# EAGLE design UserInterface_RevC (EAGLE 7.6.0)

## Sheet 1 of 2
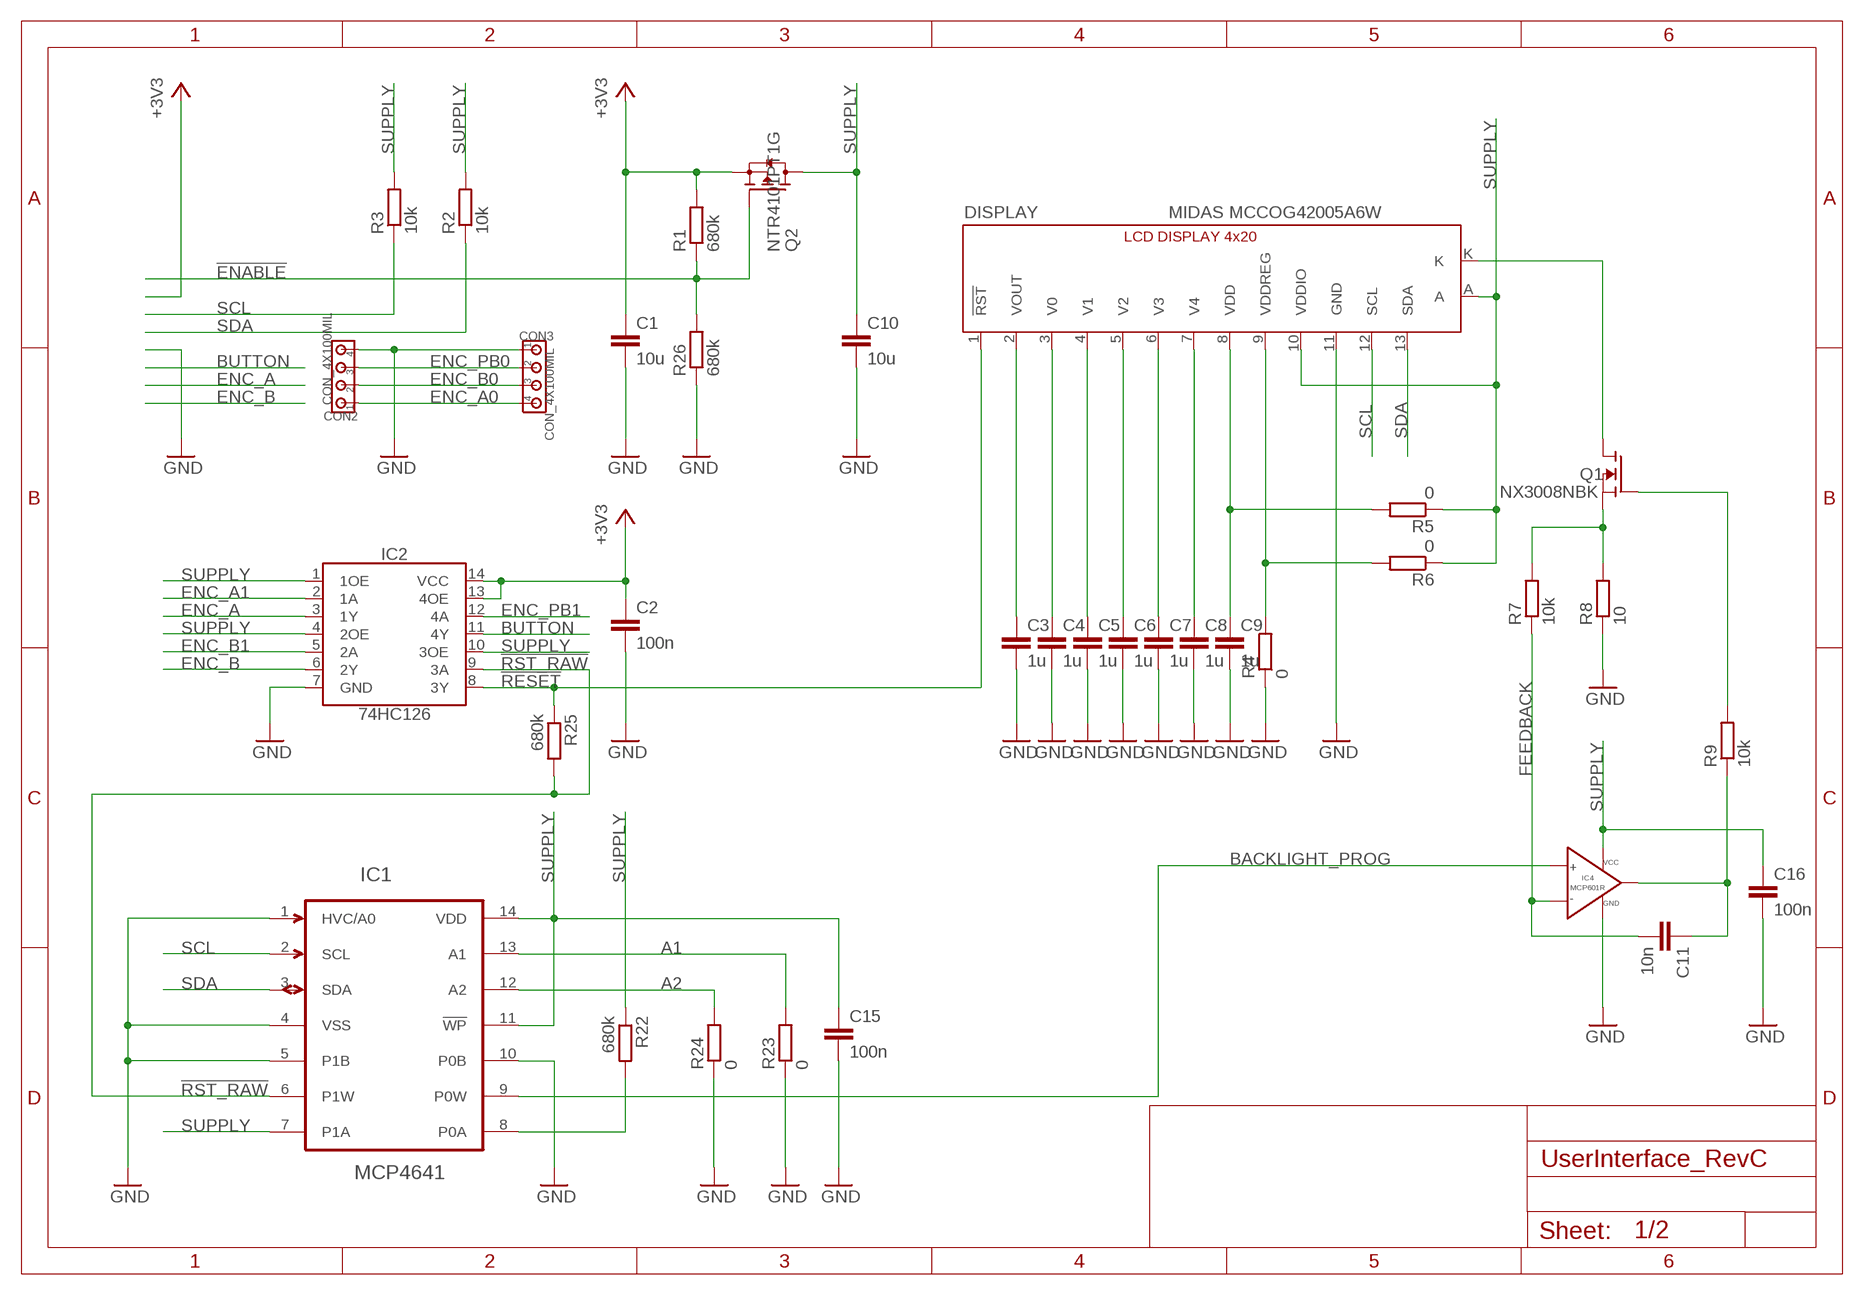
[diagram p0: schematic, sheet 1]

### Parts
C1  10u  CC0805  [C0805]
C2  100n  CC0805  [C0805]
C3  1u  CC0805  [C0805]
C4  1u  CC0805  [C0805]
C5  1u  CC0805  [C0805]
C6  1u  CC0805  [C0805]
C7  1u  CC0805  [C0805]
C8  1u  CC0805  [C0805]
C9  1u  CC0805  [C0805]
C10  10u  CC0805  [C0805]
C11  10n  CC0805  [C0805]
C15  100n  CC0805  [C0805]
C16  100n  CC0805  [C0805]
CON2  CON_4X100MIL  [100MIL_4X]
CON3  CON_4X100MIL  [100MIL_4X]
DISPLAY  MIDAS MCCOG42005A6W  LCD4X20_I2C  [LCD_4X20_I2C]
IC1  MCP4641  [TSSOP14]
IC2  74HC126  [SO14]
IC4  MCP601R  [SOT-23-5]
Q1  NX3008NBK  N-FETSOT23  [SOT23]
Q2  NTR4101PT1G  P-FETSOT23  [SOT23]
R1  680k  RESISTORR0805  [R0805]
R2  10k  RESISTORR0805  [R0805]
R3  10k  RESISTORR0805  [R0805]
R4  0  RESISTORR0805  [R0805]
R5  0  RESISTORR0805  [R0805]
R6  0  RESISTORR0805  [R0805]
R7  10k  RESISTORR0805  [R0805]
R8  10  RESISTORR0805  [R0805]
R9  10k  RESISTORR0805  [R0805]
R22  680k  RESISTORR0805  [R0805]
R23  0  RESISTORR0805  [R0805]
R24  0  RESISTORR0805  [R0805]
R25  680k  RESISTORR0805  [R0805]
R26  680k  RESISTORR0805  [R0805]

### Nets
!ENABLE!: Q2.1(G) R1.1 R26.2 ; also sheet 2
!RESET!: DISPLAY.1(!RST!) IC2.8(3Y) R25.1
!RST_RAW!: IC1.6(P1W) IC2.9(3A) R25.2
+3V3: C1.1 C2.1 IC2.13(4OE) IC2.14(VCC) Q2.2(S) R1.2 ; also sheet 2
A1: IC1.13(A1) R23.2
A2: IC1.12(A2) R24.2
BACKLIGHT_PROG: IC1.9(P0W) IC4.3(VIN+)
BUTTON: IC2.11(4Y) ; also sheet 2
ENC_A: IC2.3(1Y) ; also sheet 2
ENC_A0: CON2.1 CON3.4 ; also sheet 2
ENC_A1: IC2.2(1A) ; also sheet 2
ENC_B: IC2.6(2Y) ; also sheet 2
ENC_B0: CON2.2 CON3.3 ; also sheet 2
ENC_B1: IC2.5(2A) ; also sheet 2
ENC_PB0: CON2.3 CON3.2 ; also sheet 2
ENC_PB1: IC2.12(4A) ; also sheet 2
FEEDBACK: C11.2 IC4.4(VIN-) R7.1
GND: C1.2 C2.2 C3.2 C4.2 C5.2 C6.2 C7.2 C8.2 C9.2 C10.2 C15.2 C16.2 CON2.4 CON3.1 DISPLAY.11(GND) IC1.1(HVC/A0) IC1.4(VSS) IC1.5(P1B) IC1.10(P0B) IC2.7(GND) IC4.5(GND) R4.1 R8.1 R23.1 R24.1 R26.1 ; also sheet 2
LED_K: DISPLAY.K Q1.3(D)
N$3: C3.1 DISPLAY.2(VOUT)
N$4: C4.1 DISPLAY.3(V0)
N$5: C8.1 DISPLAY.7(V4)
N$6: C7.1 DISPLAY.6(V3)
N$7: C6.1 DISPLAY.5(V2)
N$8: C5.1 DISPLAY.4(V1)
N$14: C11.1 IC4.1(VOUT) R9.1
N$15: Q1.1(G) R9.2
N$17: Q1.2(S) R7.2 R8.2
N$19: IC1.8(P0A) R22.2
SCL: DISPLAY.12(SCL) IC1.2(SCL) R3.1 ; also sheet 2
SDA: DISPLAY.13(SDA) IC1.3(SDA) R2.1 ; also sheet 2
SUPPLY: C10.1 C15.1 C16.1 DISPLAY.10(VDDIO) DISPLAY.A IC1.7(P1A) IC1.11(!WP!) IC1.14(VDD) IC2.1(1OE) IC2.4(2OE) IC2.10(3OE) IC4.2(VCC) Q2.3(D) R2.2 R3.2 R5.1 R6.1 R22.1 ; also sheet 2
VDD: C9.1 DISPLAY.8(VDD) R5.2
VDREG: DISPLAY.9(VDDREG) R4.2 R6.2

## Sheet 2 of 2
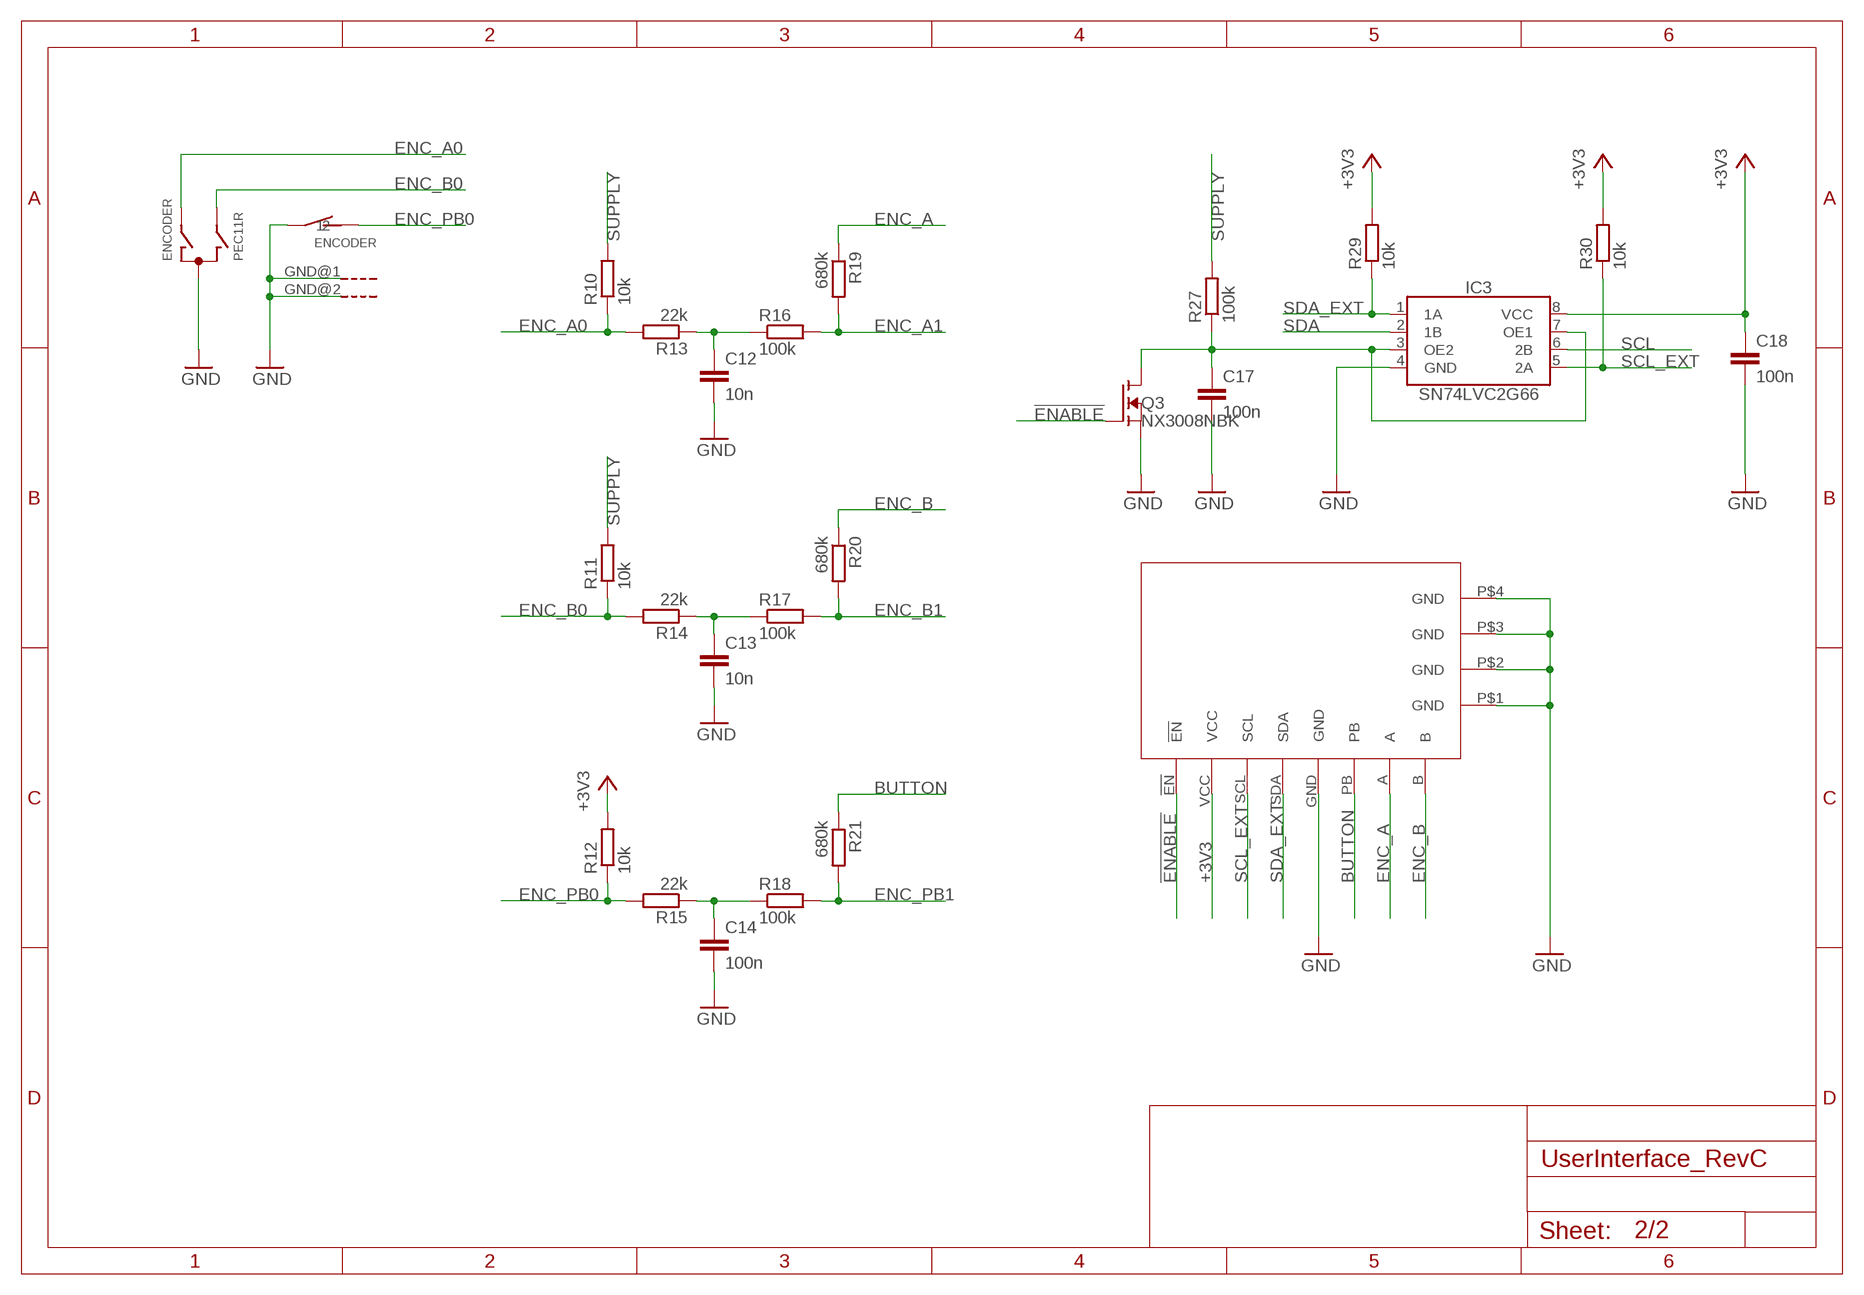
[diagram p1: schematic, sheet 2]

### Parts
C12  10n  CC0805  [C0805]
C13  10n  CC0805  [C0805]
C14  100n  CC0805  [C0805]
C17  100n  CC0805  [C0805]
C18  100n  CC0805  [C0805]
ENCODER  PEC11R  ENCODER_BOURNS  [ENCODER_BOURNS]
IC3  SN74LVC2G66  [SSOP8]
Q3  NX3008NBK  N-FETSOT23  [SOT23]
R10  10k  RESISTORR0805  [R0805]
R11  10k  RESISTORR0805  [R0805]
R12  10k  RESISTORR0805  [R0805]
R13  22k  RESISTORR0805  [R0805]
R14  22k  RESISTORR0805  [R0805]
R15  22k  RESISTORR0805  [R0805]
R16  100k  RESISTORR0805  [R0805]
R17  100k  RESISTORR0805  [R0805]
R18  100k  RESISTORR0805  [R0805]
R19  680k  RESISTORR0805  [R0805]
R20  680k  RESISTORR0805  [R0805]
R21  680k  RESISTORR0805  [R0805]
R27  100k  RESISTORR0805  [R0805]
R29  10k  RESISTORR0805  [R0805]
R30  10k  RESISTORR0805  [R0805]
U$1  DISPLAY_UNIT  [DISPLAY_UNIT]

### Nets
!ENABLE!: Q3.1(G) U$1.!EN! ; also sheet 1
+3V3: C18.1 IC3.8(VCC) R12.2 R29.2 R30.2 U$1.VCC ; also sheet 1
BUTTON: R21.1 U$1.PB ; also sheet 1
ENC_A: R19.1 U$1.A ; also sheet 1
ENC_A0: ENCODER.A R10.1 R13.2 ; also sheet 1
ENC_A1: R16.2 R19.2 ; also sheet 1
ENC_B: R20.1 U$1.B ; also sheet 1
ENC_B0: ENCODER.B R11.1 R14.2 ; also sheet 1
ENC_B1: R17.2 R20.2 ; also sheet 1
ENC_PB0: ENCODER.1 R12.1 R15.2 ; also sheet 1
ENC_PB1: R18.2 R21.2 ; also sheet 1
GND: C12.2 C13.2 C14.2 C17.2 C18.2 ENCODER.2 ENCODER.C ENCODER.GND@1(G) ENCODER.GND@2(G) IC3.4(GND) Q3.2(S) U$1.GND U$1.P$1(GND) U$1.P$2(GND) U$1.P$3(GND) U$1.P$4(GND) ; also sheet 1
N$1: C17.1 IC3.3(OE2) IC3.7(OE1) Q3.3(D) R27.1
N$9: C13.1 R14.1 R17.1
N$12: C12.1 R13.1 R16.1
N$13: C14.1 R15.1 R18.1
SCL: IC3.6(2B) ; also sheet 1
SCL_EXT: IC3.5(2A) R30.1 U$1.SCL
SDA: IC3.2(1B) ; also sheet 1
SDA_EXT: IC3.1(1A) R29.1 U$1.SDA
SUPPLY: R10.2 R11.2 R27.2 ; also sheet 1

## Library data of the parts
C1-C18 = 00Capacitor:C: Capacitor
CON2 CON3 = 00Connector:CON_4X: 4-pin header
DISPLAY = 00Display:LCD4X20_I2C: 4x20 character LCD display with I2C interface
ENCODER = 00Switch:ENCODER_BOURNS: Bourns Rotary Encoder with Switch PEC11-4xxxF-Sxxxx
IC1 = 00DigiPot:MCP4641: Dual DigiPot with 128 steps and non-volatile memory
IC2 = 00Logic:74HC126: Quad buffer/line driver; 3-state
IC3 = 00Logic:SN74LVC2G66: Dual Bilateral Analog Switch
IC4 = 00OpAmp:MCP601R
Q1 Q3 = 00Mosfet:N-FET: N-Channel MOSFET
Q2 = 00Mosfet:P-FET
R1-R27 R29 R30 = 00Resistor:RESISTOR: RESISTOR, European symbol
U$1 = 00Drill:DISPLAY_UNIT: Display Unit

## Board
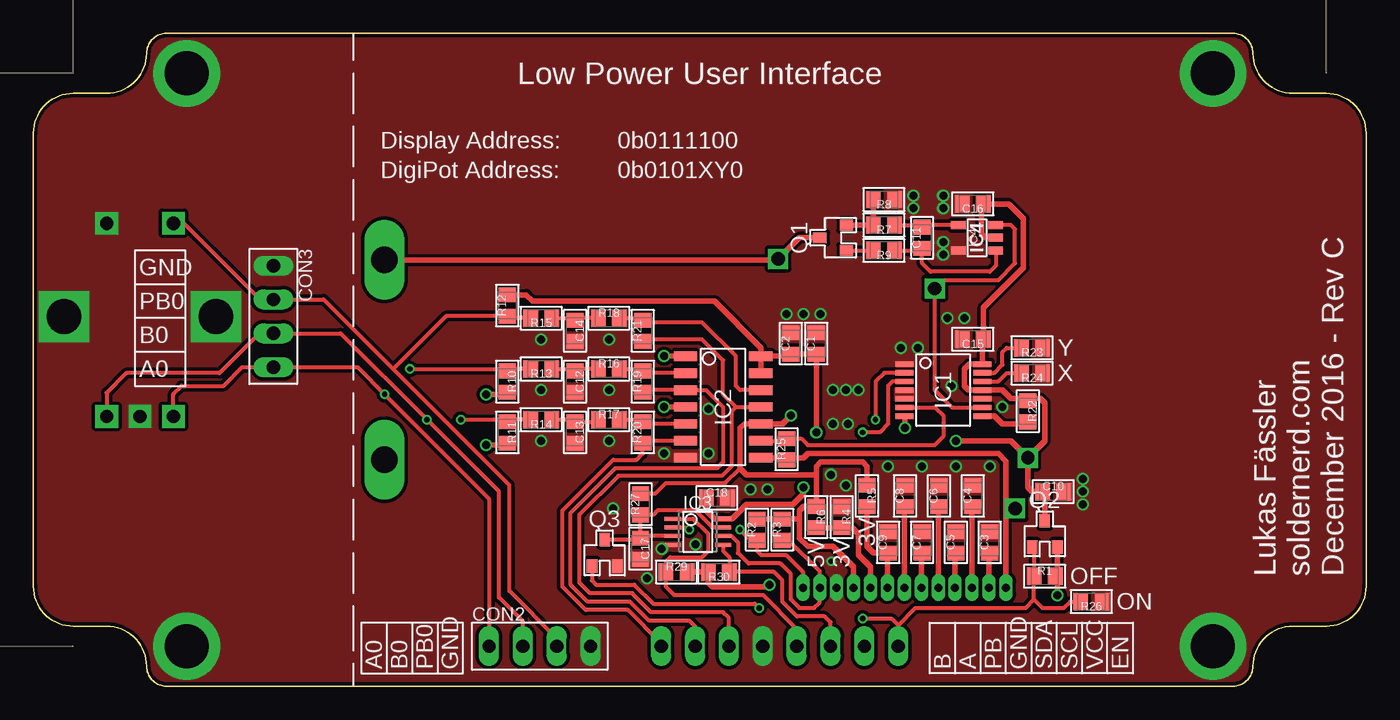
[diagram p2: board, top side]
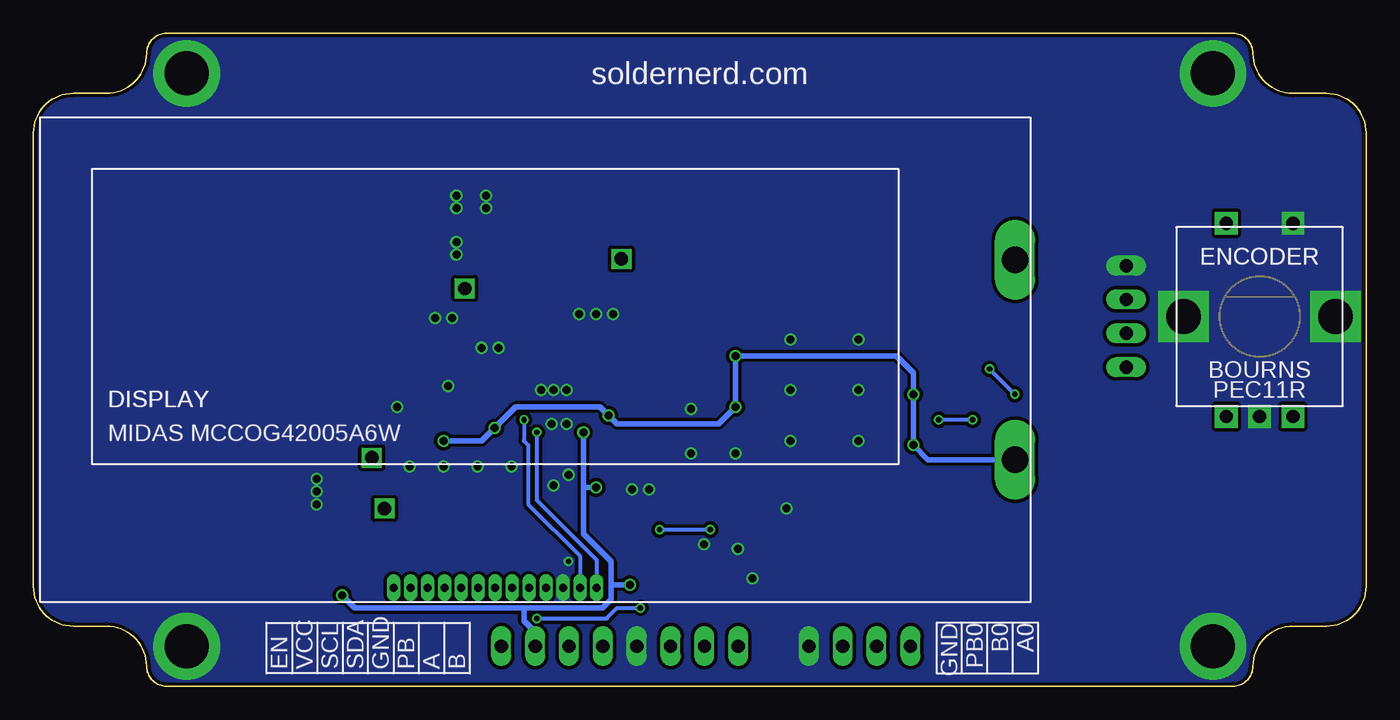
[diagram p3: board, bottom side, seen from below]

Size 100 x 49 mm. Coordinates in mm from the lower left corner, seen from the top.
Outline: 0,41.5 arc-90 3,44.5 5.5,44.5 arc90 8.5,47.5 arc-90 10,49 90,49 arc-90 91.5,47.5 arc90 94.5,44.5 97,44.5 arc-90 100,41.5 100,7.5 arc-90 97,4.5 94.5,4.5 arc90 91.5,1.5 arc-90 90,0 10,0 arc-90 8.5,1.5 arc90 5.5,4.5 3,4.5 arc-90 0,7.5 0,41.5
Copper layers (1*16): Top 0.035mm / dielectric 1.5mm / Bottom 0.035mm
Design rules "dirt_cheap_dirty_boards.8mil": minimum track width 5mil, minimum drill 12mil, track to track 8mil, track to pad 8mil, pad to pad 8mil, via to via 8mil, smd to smd 0mil, copper to edge 10mil, drill to drill 10mil, minimum pad ring 8mil, minimum via ring 6mil, stop-mask expansion 2mil, vias tented up to drill 25mil, thermal gap 10mil

### Footprints (pad centres in the part's own frame; a part is rotated, then mirrored left to right if it is on the bottom)
C0805 = smd 1.1 x 1.3: 1 -0.8,0; 2 0.8,0
100MIL_4X = drill 1 long: 1 -3.81,0; 2 -1.27,0; 3 1.27,0; 4 3.81,0
LCD_4X20_I2C = drill 0.6 pad 0.9 long: 1 26.53,1.1; 2 27.8,1.1; 3 29.07,1.1; 4 30.34,1.1; 5 31.61,1.1; 6 32.88,1.1; 7 34.15,1.1; 8 35.42,1.1; 9 36.69,1.1; 10 37.96,1.1; 11 39.23,1.1; 12 40.5,1.1; 13 41.77,1.1 | drill 2 long: A 73.15,10.7; K 73.15,25.7
ENCODER_BOURNS = drill 1 pad 1.7 square: 1 -2.5,7; 2 2.5,7; A -2.5,-7.5; B 2.5,-7.5; C 0,-7.5 | drill 2.6 pad 3.8 square: GND@1 -5.7,0; GND@2 5.7,0
TSSOP14 = smd 0.4 x 1.35: 1 -1.95,-2.925; 2 -1.3,-2.925; 3 -0.65,-2.925; 4 0,-2.925; 5 0.65,-2.925; 6 1.3,-2.925; 7 1.95,-2.925; 8 1.95,2.925; 9 1.3,2.925; 10 0.65,2.925; 11 0,2.925; 12 -0.65,2.925; 13 -1.3,2.925; 14 -1.95,2.925
SO14 = smd 0.7 x 1.75: 1 -3.81,-2.825; 2 -2.54,-2.825; 3 -1.27,-2.825; 4 0,-2.825; 5 1.27,-2.825; 6 2.54,-2.825; 7 3.81,-2.825; 8 3.81,2.825; 9 2.54,2.825; 10 1.27,2.825; 11 0,2.825; 12 -1.27,2.825; 13 -2.54,2.825; 14 -3.81,2.825
SSOP8 = smd 1.2 x 0.3: 1 -1.9,0.975; 2 -1.9,0.325; 3 -1.9,-0.325; 4 -1.9,-0.975; 5 1.9,-0.975; 6 1.9,-0.325; 7 1.9,0.325; 8 1.9,0.975
SOT-23-5 = smd 0.6 x 1.1: 1 -0.95,-1.4; 2 0,-1.4; 3 0.95,-1.4; 4 0.95,1.4; 5 -0.95,1.4
SOT23 = smd 0.8 x 1: 1 -0.95,-1; 2 0.95,-1; 3 0,1
R0805 = smd 1.1 x 1.3: 1 -0.8,0; 2 0.8,0
DISPLAY_UNIT = drill 1 long: !EN! 35.11,3; A 50.35,3; B 52.89,3; GND 45.27,3; PB 47.81,3; SCL 40.19,3; SDA 42.73,3; VCC 37.65,3 | drill 3.3 pad 5: P$1 11.5,3; P$2 88.5,3; P$3 11.5,46; P$4 88.5,46

### Placement (x,y rotation side)
C1  58.74,25.72 90 top
C2  56.83,25.72 90 top
C3  71.75,10.79 90 top
C4  70.48,14.29 90 top
C5  69.22,10.79 90 top
C6  67.94,14.29 90 top
C7  66.67,10.79 90 top
C8  65.41,14.29 90 top
C9  64.14,10.79 90 top
C10  76.52,14.61 0 top
C11  66.67,33.66 90 top
C12  40.64,22.86 270 top
C13  40.64,19.05 270 top
C14  40.64,26.67 270 top
C15  70.48,26.04 180 top
C16  70.48,36.2 180 top
C17  45.56,10.32 270 top
C18  51.28,14.13 0 top
CON2  38,3 0 top
CON3  18,27.75 270 top
DISPLAY  99.5,6.3 0 bottom
ENCODER  8,27.75 0 bottom
IC1  68.26,22.23 270 top
IC2  51.75,20.95 270 top
IC3  49.85,11.59 0 top
IC4  70.8,33.66 90 top
Q1  60.01,33.66 90 top
Q2  75.88,11.43 0 top
Q3  42.86,10 0 top
R1  75.88,8.26 0 top
R2  54.29,11.75 90 top
R3  56.2,11.75 90 top
R4  60.64,12.7 270 top
R5  62.55,14.29 270 top
R6  58.74,12.7 270 top
R7  63.82,34.61 180 top
R8  63.82,36.51 180 top
R9  63.82,32.7 180 top
R10  35.56,22.86 270 top
R11  35.56,19.05 270 top
R12  35.56,28.57 90 top
R13  38.1,23.81 180 top
R14  38.1,20 180 top
R15  38.1,27.62 180 top
R16  43.18,23.81 0 top
R17  43.18,20 0 top
R18  43.18,27.62 0 top
R19  45.72,22.86 90 top
R20  45.72,19.05 90 top
R21  45.72,26.67 90 top
R22  74.61,20.64 270 top
R23  74.93,25.4 180 top
R24  74.93,23.5 180 top
R25  56.52,17.78 90 top
R26  79.38,6.35 180 top
R27  45.56,13.65 90 top
R29  48.26,8.57 0 top
R30  51.44,8.57 180 top
U$1  100,0 0 bottom

### Tracks (layer width: path | path; a pad name or v marks a point on that pad's centre or on a via)
!ENABLE!  (via drill 0.4)
  Top 0.305: 64.89,4.57 66.2,5.87 74.45,5.87 75.08,6.5 | 75.08,6.5 R1.1 75.08,10.28 | 75.08,6.5 75.71,5.87 77.31,5.87 77.79,6.35 R26.2 | 64.89,4.57 U$1.!EN! | Q3.1 41.91,7.93 42.23,7.62 45.09,7.62 46.51,6.19 54.13,6.19 v54.45,5.87 | v62.23,5.08 64.38,5.08 64.89,4.57
  Top 0.406: Q2.1 75.08,10.28
  Bottom 0.305: v62.23,5.08 56.99,5.08 56.2,5.87 v54.45,5.87
!RESET!  (via drill 1)
  Top 0.406: DISPLAY.1 72.97,13.34 | 72.97,13.34 72.97,16.88 72.39,17.46 58.1,17.46 57.78,17.14 56.52,17.14 R25.1 56.35,17.14 IC2.8 | v73.66,13.34 72.97,13.34
!RST_RAW!
  Top 0.305: IC2.9 56.35,18.41 | R25.2 57.62,18.58 58.1,18.1 67.63,18.1 68.26,18.73 68.26,20.32 67.66,20.93 IC1.6
  Top 0.406: 56.35,18.41 R25.2
+3V3  (via drill 0.6)
  Top 0.305: R30.2 50.63,7.94
  Top 0.406: v58.74,19.05 C1.1 C2.1 56.83,24.8 54.61,24.8 | R12.2 36.98,29.38 37.47,28.89 51.12,28.89 54.61,25.4 54.61,24.8 | IC2.13 IC2.14 54.61,24.8 | Q2.2 76.83,8.4 | v76.83,6.83 76.83,8.1 | R29.2 R30.2 50.63,7.79 50.96,7.46 55.09,7.46 v55.24,7.62 | C18.1 50.48,13.18 51.09,12.56 IC3.8 52.41,12.56 53.5,13.65 56.99,13.65 57.78,14.45 v57.78,14.92
  Top 0.61: 76.83,8.1 R1.2 76.83,8.4
  Bottom 0.406: 58.74,14.92 58.74,11.43 56.67,9.37 56.67,7.62 | 58.74,14.92 v58.74,19.05 | v76.83,6.83 75.88,5.87 63.18,5.87 | 63.18,5.87 57.31,5.87 56.67,6.51 56.67,7.62 | v55.24,7.62 56.67,7.62 | v57.78,14.92 58.74,14.92 | U$1.VCC 62.35,4.09 63.18,4.92 63.18,5.87
A1
  Top 0.305: IC1.13 72.1,23.52 72.71,24.13 72.71,25.08 73.03,25.4 R23.2
A2
  Top 0.305: IC1.12 72.41,22.88 73.03,23.5 R24.2
BACKLIGHT_PROG  (via drill 1)
  Top 0.305: IC1.9 68.93,20.93 67.63,22.23 v67.63,29.84 68.26,30.48 72.39,30.48 73.66,31.75 73.66,34.29 73.34,34.61 IC4.3
  Top 0.406: IC4.3
BUTTON
  Top 0.305: 45.88,26.04 50.16,26.04 51.75,24.45 51.75,21.91 52.7,20.95 | 52.7,20.95 IC2.11 | U$1.PB 52.19,5.12 51.75,5.56 46.35,5.56 44.93,6.99 41.75,6.99 40.96,7.78 40.96,12.86 43.89,15.8 51.67,15.8 52.39,16.51 52.39,20.64 52.7,20.95
  Top 0.406: 45.88,26.04 R21.1
ENC_A
  Top 0.305: 45.88,22.23 IC2.3 50.48,22.23 51.75,20.95 51.75,16.83 51.28,16.35 43.66,16.35 40.32,13.02 40.32,7.62 41.59,6.35 44.77,6.35 46.2,4.92 49.21,4.92 49.65,4.48 U$1.A
  Top 0.406: 45.88,22.23 R19.1
ENC_A0  (via drill 0.4)
  Top 0.305: ENCODER.A 10.5,21.93 11.11,22.54 14.29,22.54 15.69,23.94 CON3.4 24.32,23.94 v26.35,21.91 34.19,14.07 CON2.1 | v28.26,23.81 35.41,23.81 | R13.2 35.71,23.81
  Top 0.406: 35.41,23.81 R10.1 35.71,23.81
  Bottom 0.305: v28.26,23.81 v26.35,21.91
ENC_A1
  Top 0.305: R16.2 45.57,23.81 | IC2.2 45.88,23.5
  Top 0.406: 45.57,23.81 R19.2 45.88,23.5
ENC_B
  Top 0.305: IC2.6 45.88,18.41 | R20.1 45.72,17.46 45.24,16.99 43.5,16.99 39.69,13.18 39.69,7.46 41.43,5.71 44.61,5.71 47.11,3.21 U$1.B
  Top 0.406: 45.88,18.41 R20.1
ENC_B0  (via drill 0.4)
  Top 0.305: ENCODER.B 5.5,22.01 6.99,23.5 13.97,23.5 16.95,26.48 CON3.3 23.05,26.48 v29.53,20 34.92,14.61 34.92,6.67 36.73,4.86 CON2.2 | v32.07,20 35.41,20 | R14.2 35.71,20
  Top 0.406: 35.41,20 R11.1 35.71,20
  Bottom 0.305: v32.07,20 v29.53,20
ENC_B1
  Top 0.305: R17.2 45.57,20 | IC2.5 45.88,19.68
  Top 0.406: 45.57,20 R20.2 45.88,19.68
ENC_PB0
  Top 0.305: 26.99,23.81 21.78,29.02 CON3.2 17.02,29.02 11.29,34.75 ENCODER.1 | 26.99,23.81 35.72,15.08 35.72,7.14 39.27,3.59 CON2.3 | R15.2 35.71,27.62 | R12.1 30.95,27.77 26.99,23.81
  Top 0.406: 35.71,27.62 R12.1
ENC_PB1
  Top 0.305: IC2.12 53.02,22.23 52.7,22.54 52.7,24.77 50.16,27.3 45.88,27.3 | R18.2 45.57,27.62
  Top 0.406: 45.57,27.62 R21.2 45.88,27.3
FEEDBACK
  Top 0.305: R7.1 66.52,34.61 | IC4.4 66.83,34.6
  Top 0.406: 66.52,34.61 C11.2 66.83,34.6
GND  (via drill 0.4, 0.6)
  other vias: 38.1,26.04 43.18,26.04 43.18,22.23 38.1,22.23 38.1,18.41 43.18,18.41 59.85,15.88 60.96,15.08 66.04,36.83 68.58,27.62 66.04,35.88 69.85,27.62 65.09,25.4 66.36,25.4 68.9,22.54 72.71,20.95 46.04,8.1 47.31,17.46 64.14,16.51 66.67,16.51 69.22,16.51 56.52,27.94 57.78,27.94 59.05,27.94 78.74,14.61 78.74,13.65 60.01,22.23 60.96,22.23 60.01,19.68 61.12,19.68 71.75,16.51 47.15,10.32 53.82,14.76 55.09,14.76 78.74,15.56 68.26,32.38 68.26,35.88 68.26,36.83 68.26,33.34 61.91,22.23 50.64,20.8 50.64,17.46 43.5,13.34 49.69,10.64 59.85,9.37
  pour Bottom (isolate 0.254, rank 2, no thermals): 12,49 10,49 arc90 8.5,47.5 arc-90 5.5,44.5 4,44.5 3,44.5 arc90 0,41.5 0,35 0,7.5 arc90 3,4.5 4.5,4.5 5.5,4.5 arc-90 8.5,1.5 arc90 10,0 11,0 90,0 arc90 91.5,1.5 arc-90 94.5,4.5 96,4.5 97,4.5 arc90 100,7.5 100,9 100,41.5 arc90 97,44.5 95.5,44.5 94.5,44.5 arc-90 91.5,47.5 arc90 90,49 87.5,49
  pour Top (isolate 0.254, rank 2, no thermals): 0,34.5 0,7.5 arc90 3,4.5 4.5,4.5 5.5,4.5 arc-90 8.5,1.5 arc90 10,0 15.5,0 90,0 arc90 91.5,1.5 arc-90 94.5,4.5 96,4.5 97,4.5 arc90 100,7.5 100,11 100,41.5 arc90 97,44.5 95,44.5 94.5,44.5 arc-90 91.5,47.5 arc90 90,49 88,49 20,49 10,49 arc90 8.5,47.5 arc-90 5.5,44.5 4,44.5 3,44.5 arc90 0,41.5
LED_K  (via drill 1)
  Top 0.406: Q1.3 57.47,33.66 v55.88,32.07 55.81,32 DISPLAY.K
N$1
  Top 0.305: C17.1 R27.1 46.51,12.86 46.83,13.18 49.69,13.18 50.95,11.91 IC3.7 | Q3.3 45.56,11 C17.1 | IC3.3 45.56,11.26 C17.1
N$3
  Top 0.406: DISPLAY.2 71.7,9.94 C3.1
N$4
  Top 0.406: DISPLAY.3 70.43,13.43 C4.1
N$5
  Top 0.406: DISPLAY.7 65.35,13.43 C8.1
N$6
  Top 0.406: DISPLAY.6 66.62,9.94 C7.1
N$7
  Top 0.406: DISPLAY.5 67.89,13.43 C6.1
N$8
  Top 0.406: DISPLAY.4 69.16,9.94 C5.1
N$9
  Top 0.305: R14.1 40.49,20 | C13.1 42.23,19.85
  Top 0.406: 40.49,20 C13.1 | 42.23,19.85 R17.1
N$12
  Top 0.305: R16.1 40.79,23.81 | R13.1 40.49,23.81
  Top 0.406: 40.79,23.81 C12.1 40.49,23.81
N$13
  Top 0.305: R15.1 40.49,27.62 | R18.1 40.79,27.62
  Top 0.406: 40.49,27.62 C14.1 40.79,27.62
N$14
  Top 0.305: R9.1 66.52,32.7 | IC4.1 72.2,31.56 71.75,31.11 67.31,31.11 66.67,31.75 C11.1
  Top 0.406: R9.1 | 66.52,32.7 C11.1
N$15
  Top 0.305: Q1.1 R9.2
  Top 0.406: R9.2
N$17
  Top 0.406: R8.2 R7.2 Q1.2
N$19
  Top 0.406: IC1.8 72.12,20.27 72.71,19.68 74.46,19.68 R22.2
SCL  (via drill 0.4)
  Top 0.305: IC1.2 63.85,23.52 63.18,22.86 v63.18,20 | IC3.6 52.4,11.26 52.86,10.79 52.86,10 53.66,9.21 56.04,9.21 56.83,8.41 56.83,6.51 57.47,5.87 58.58,5.87 59,6.29 DISPLAY.12 59,8.63 56.67,10.95 R3.1
  Bottom 0.305: v63.18,20 63.18,18.41 62.87,18.1 62.87,13.65 59,9.79 DISPLAY.12
SCL_EXT
  Top 0.305: U$1.SCL 59.81,4.8 59.37,5.24 57.31,5.24 56.2,6.35 56.2,7.94 55.56,8.57 R30.1 52.23,9.68 51.75,10.16 IC3.5
SDA  (via drill 0.4)
  Top 0.305: IC1.3 64.47,22.88 64.14,22.54 64.14,19.68 63.5,19.05 v62.23,19.05 | DISPLAY.13 57.73,8.57 56.46,9.84 54.61,9.84 54.29,10.16 R2.1 53.82,10.95 v53.02,11.75 | IC3.2 49.05,11.91 v49.21,11.75
  Bottom 0.305: v62.23,19.05 62.23,13.97 57.73,9.47 DISPLAY.13 | v49.21,11.75 v53.02,11.75
SDA_EXT
  Top 0.305: 47.31,8.42 R29.1 | 47.62,8.41 R29.1 | U$1.SDA 57.27,4.33 54.77,6.83 48.1,6.83 47.47,7.46 R29.1 | R29.1 | R29.1 47.46,9.36 47.78,9.68 50.16,9.68 50.64,10.16 50.64,11.43 49.51,12.56 IC3.1
SUPPLY  (via drill 0.6, 1)
  Top 0.305: IC1.7 65.41,20.21 | 54.29,12.56 R2.2 54.28,12.56 | 45.88,14.13 R27.2 46.68,14.45 47.47,15.24 51.91,15.24 53.02,16.35
  Top 0.406: IC2.1 v47.31,24.77 | IC2.4 v47.31,20.95 | v33.98,21.91 v33.97,21.91 35.41,21.91 R10.2 | v33.97,18.1 v33.98,18.1 35.41,18.1 R11.2 | DISPLAY.10 61.54,8.95 60.01,10.48 58.1,10.48 57.47,11.11 57.47,12.55 | R2.2 R3.2 57.47,12.55 | 75.88,14.61 C10.1 74.93,14.61 74.61,14.92 v74.61,17.14 | v56.83,20.32 56.2,19.68 IC2.10 53.34,19.68 53.02,19.37 53.02,16.35 53.5,15.88 58.74,15.88 | v69.22,18.41 73.34,18.41 v74.61,17.14 | R5.1 62.55,16.51 62.23,16.83 59.05,16.83 58.74,16.51 58.74,15.88 | 58.74,15.88 R6.1 57.78,13.49 57.47,13.18 57.47,12.55 | Q2.3 75.88,14.44 | v74.61,17.14 75.88,18.41 75.88,21.27 75.56,21.59 74.61,21.59 R22.1 74.46,21.59 73.34,21.59 72.71,22.23 IC1.11 70.17,22.23 69.85,22.54 69.85,23.81 70.21,24.18 IC1.14 71.19,26.04 C15.1 71.28,28.42 74.3,31.43 74.3,35.08 73.18,36.2 C16.1 71.12,36.03 71.12,33.97 71.44,33.66 IC4.2 | v65.41,19.37 65.41,20.21
  Top 0.61: 75.88,14.44 C10.1
  Bottom 0.406: DISPLAY.A 32.88,17 v33.97,18.1 v33.97,21.91 33.97,23.5 35.24,24.77 v47.31,24.77 v47.31,20.95 48.58,19.68 56.2,19.68 v56.83,20.32 57.47,20.95 63.82,20.95 v65.41,19.37 66.36,18.41 v69.22,18.41
VDD
  Top 0.406: DISPLAY.8 64.08,9.94 C9.1 63.03,9.99 62.55,10.48 R5.2
VDREG
  Top 0.406: DISPLAY.9 62.81,8.95 61.91,9.84 61.91,11.43 61.44,11.9 R4.2 R6.2

### Text on the board
tPlace: Low Power User Interface | Display Address: | 0b0111100 | DigiPot Address: | 0b0101XY0 | GND | PB0 | B0 | Y | A0 | X | 3V | 5V | 3V | OFF | Lukas Fässler | soldernerd.com | December 2016 - Rev C | ON | A0 | B0 | PB0 | GND | B | A | PB | GND | SDA | SCL | VCC | EN
bPlace: soldernerd.com | A0 | B0 | PB0 | GND | B | A | PB | GND | SDA | SCL | VCC | EN